# Altium schematic sheet SCIENCE_LED_BOARD.SchDoc: SPEXTRO - LED BOARD
size A4; Author: Matthew Glazer; Organization: RIT/SPEX; Address1: Rochester Institute of Technology; Address2: Rochester; Address3: New York; Address4: USA; Revision: 1A; SheetNumber: 1; SheetTotal: 1
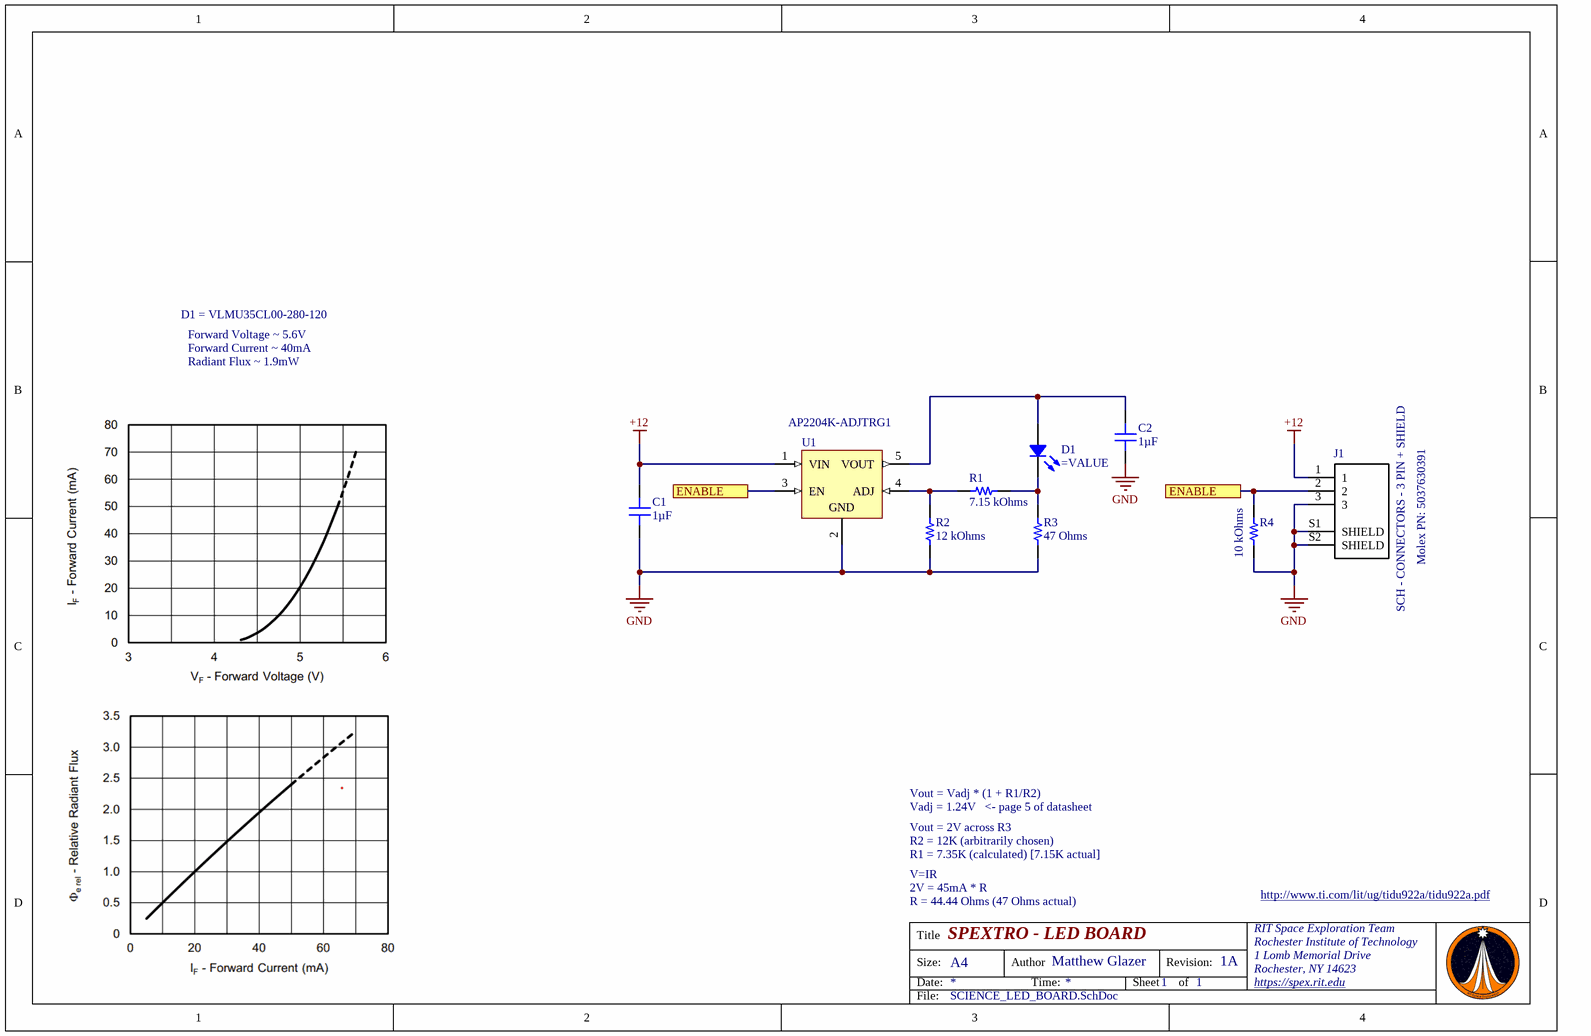
[diagram p0: SCIENCE_LED_BOARD.SchDoc]

## Parts
C1  1µF  [CAP 0603_1608]
C2  1µF  [CAP 0603_1608]
D1  (no value)  [PCB - LED - VISHAY 1414_3535 UV]
J1  SCH - CONNECTORS - 3 PIN + SHIELD  [PCB - CONNECTOR - MOLEX - PICO-LOCK 5037630391]
R1  7.15 kOhms  [RES 0603_1608]
R2  12 kOhms  [RES 0603_1608]
R3  47 Ohms  [RES 0603_1608]
R4  10 kOhms  [RES 0603_1608]
U1  AP2204K-ADJTRG1  [DIOD-SOT23-5_V]

## Ports
ENABLE

## Nets
+12: C1.2 J1.1 U1.1(VIN)
GND: C1.1 C2.1 J1.3 J1.S1(SHIELD) J1.S2(SHIELD) R2.1 R3.1 R4.1 U1.2(GND)
ENABLE: J1.2 R4.2 U1.3(EN) ; port ENABLE
NetC2_2: C2.2 D1.1 U1.5(VOUT)
NetD1_2: D1.2 R1.2 R3.2
NetR1_1: R1.1 R2.2 U1.4(ADJ)

## Notes on the sheet
- D1 = VLMU35CL00-280-120
- Forward Voltage ~ 5.6V
- Radiant Flux ~ 1.9mW
- Forward Current ~ 40mA
- Molex PN: 5037630391
- Vout = Vadj * (1 + R1/R2)
- Vadj = 1.24V   <- page 5 of datasheet
- R2 = 12K (arbitrarily chosen)
- Vout = 2V across R3
- R1 = 7.35K (calculated) [7.15K actual]
- V=IR
- 2V = 45mA * R
- R = 44.44 Ohms (47 Ohms actual)
- http://www.ti.com/lit/ug/tidu922a/tidu922a.pdf
- Title
- Size:
- Date:
- A4
- Author
- Time:
- Sheet
- Revision:
- of
- RIT Space Exploration Team
- Rochester Institute of Technology
- 1 Lomb Memorial Drive
- Rochester, NY 14623
- https://spex.rit.edu
- File:

## Library data of the parts
C1 C2 = CC0603KRX5R8BB105: CAP CER 1UF 25V X5R 0603; Manufacturer: Yageo; Tolerance: ±10%; Part Number: CC0603KRX5R8BB105; Value: 1µF; Applications: General Purpose; Capacitance: 1µF; ComponentLink1Description: Datasheet; ComponentLink1URL: https://www.yageo.com/upload/media/product/productsearch/datasheet/mlcc/UPY-GPHC_X5R_4V-to-50V_25.pdf; ComponentLink2Description: DigiKey Link; ComponentLink2URL: http://digikey.com/product-detail/en/yageo/CC0603KRX5R8BB105/311-1445-1-ND/2833751; Device Package: 0603 (1608 Metric); LastUpdated: 1/21/2020 12:02:05 AM; Lifecycle Status: Active; Minimum Order: 1; Mounting Type: Surface Mount, MLCC; Operating Temperature: -55°C ~ 85°C; Package / Case: 0603 (1608 Metric); Packaging: TapeAndReel; PartId: 5146; Part Status: Active; Price: 0.01; Series: CC; Size / Dimension: 0.063" L x 0.031" W (1.60mm x 0.80mm); Supplier 1: DigiKey; Supplier Part Number 1: 311-1445-1-ND; Temperature Coefficient: X5R; Thickness (Max): 0.035" (0.90mm); Voltage - Rated: 25V
D1 = LED: Chip LED
J1 = SCH - CONNECTORS - 3 PIN + SHIELD: Connector Header Surface Mount, Right Angle 4 position 0.039 _1.00mm_; MF: Molex; MP: 5037630391; SnapEDA_Link: https://www.snapeda.com/parts/5037630491/Molex/view-part/3215405/?ref=snap; Package: None; Price: None; Availability: Unavailable; Value: *
R1 = RMCF0603FT7K15: RES 7.15K OHM 1% 1/10W 0603; Manufacturer: Stackpole Electronics Inc; Power (Watts): 0.1W, 1/10W; Temperature Coefficient: ±100ppm/°C; Part Number: RMCF0603FT7K15; Value: 7.15 kOhms; ComponentLink1Description: Datasheet; ComponentLink1URL: https://www.seielect.com/catalog/sei-packaging.pdf; ComponentLink2Description: DigiKey Link; ComponentLink2URL: http://digikey.com/product-detail/en/stackpole-electronics-inc/RMCF0603FT7K15/RMCF0603FT7K15CT-ND/1943048; Composition: Thick Film; Device Package: 0603 (1608 Metric); Features: Automotive AEC-Q200; Height - Seated (Max): 0.022" (0.55mm); LastUpdated: 1/21/2020 12:17:41 AM; Lifecycle Status: Active; Minimum Order: 1; Number of Terminations: 2; Operating Temperature: -55°C ~ 155°C; Package / Case: 0603 (1608 Metric); Packaging: CutTape; PartId: 22551; Part Status: Active; Price: 0.10; Ratings: AEC-Q200; Resistance: 7.15 kOhms; Series: RMCF; Size / Dimension: 0.061" L x 0.031" W (1.55mm x 0.80mm); Supplier 1: DigiKey; Supplier Part Number 1: RMCF0603FT7K15CT-ND; Supplier Device Package: 0603; Tolerance: ±1%
R2 = RMCF0603FT12K0: RES 12K OHM 1% 1/10W 0603; Manufacturer: Stackpole Electronics Inc; Power (Watts): 0.1W, 1/10W; Temperature Coefficient: ±100ppm/°C; Part Number: RMCF0603FT12K0; Value: 12 kOhms; ComponentLink1Description: Datasheet; ComponentLink1URL: https://www.seielect.com/catalog/sei-rmcf_rmcp.pdf; ComponentLink2Description: DigiKey Link; ComponentLink2URL: http://digikey.com/product-detail/en/stackpole-electronics-inc/RMCF0603FT12K0/RMCF0603FT12K0CT-ND/1943062; Composition: Thick Film; Device Package: 0603 (1608 Metric); Features: Automotive AEC-Q200; Height - Seated (Max): 0.022" (0.55mm); LastUpdated: 1/21/2020 12:22:42 AM; Lifecycle Status: Active; Minimum Order: 1; Number of Terminations: 2; Operating Temperature: -55°C ~ 155°C; Package / Case: 0603 (1608 Metric); Packaging: CutTape; PartId: 10636; Part Status: Active; Price: 0.10; Ratings: AEC-Q200; Resistance: 12 kOhms; Series: RMCF; Size / Dimension: 0.061" L x 0.031" W (1.55mm x 0.80mm); Supplier 1: DigiKey; Supplier Part Number 1: RMCF0603FT12K0CT-ND; Supplier Device Package: 0603; Tolerance: ±1%
R3 = RMCF0603FT47R0: RES 47 OHM 1% 1/10W 0603; Manufacturer: Stackpole Electronics Inc; Power (Watts): 0.1W, 1/10W; Temperature Coefficient: ±100ppm/°C; Part Number: RMCF0603FT47R0; Value: 47 Ohms; ComponentLink1Description: Datasheet; ComponentLink1URL: https://www.seielect.com/catalog/sei-rmcf_rmcp.pdf; ComponentLink2Description: DigiKey Link; ComponentLink2URL: http://digikey.com/product-detail/en/stackpole-electronics-inc/RMCF0603FT47R0/RMCF0603FT47R0CT-ND/1942954; Composition: Thick Film; Device Package: 0603 (1608 Metric); Features: Automotive AEC-Q200; Height - Seated (Max): 0.022" (0.55mm); LastUpdated: 1/21/2020 12:22:37 AM; Lifecycle Status: Active; Minimum Order: 1; Number of Terminations: 2; Operating Temperature: -55°C ~ 155°C; Package / Case: 0603 (1608 Metric); Packaging: CutTape; PartId: 10672; Part Status: Active; Price: 0.10; Ratings: AEC-Q200; Resistance: 47 Ohms; Series: RMCF; Size / Dimension: 0.061" L x 0.031" W (1.55mm x 0.80mm); Supplier 1: DigiKey; Supplier Part Number 1: RMCF0603FT47R0CT-ND; Supplier Device Package: 0603; Tolerance: ±1%
R4 = RMCF0603FT10K0: RES 10K OHM 1% 1/10W 0603; Manufacturer: Stackpole Electronics Inc; Power (Watts): 0.1W, 1/10W; Temperature Coefficient: ±100ppm/°C; Part Number: RMCF0603FT10K0; Value: 10 kOhms; ComponentLink1Description: Datasheet; ComponentLink1URL: https://www.seielect.com/catalog/sei-rmcf_rmcp.pdf; ComponentLink2Description: DigiKey Link; ComponentLink2URL: http://digikey.com/product-detail/en/stackpole-electronics-inc/RMCF0603FT10K0/RMCF0603FT10K0CT-ND/1943057; Composition: Thick Film; Device Package: 0603 (1608 Metric); Features: Automotive AEC-Q200; Height - Seated (Max): 0.022" (0.55mm); LastUpdated: 1/21/2020 12:15:03 AM; Lifecycle Status: Active; Minimum Order: 1; Number of Terminations: 2; Operating Temperature: -55°C ~ 155°C; Package / Case: 0603 (1608 Metric); Packaging: CutTape; PartId: 25663; Part Status: Active; Price: 0.10; Ratings: AEC-Q200; Resistance: 10 kOhms; Series: RMCF; Size / Dimension: 0.061" L x 0.031" W (1.55mm x 0.80mm); Supplier 1: DigiKey; Supplier Part Number 1: RMCF0603FT10K0CT-ND; Supplier Device Package: 0603; Tolerance: ±1%
U1 = CMP-2000-05784-1: Wide Input Voltage Range, Adjustable Output, 150 mA, -40 to 125 degC, 5-Pin SOT23, RoHS, Tape and Reel; Output Voltage: Adj; Brand: DiodesIncorporated; PSRR / Ripple Rejection - Typ: 60dB; Input Voltage MAX: 24V; Number of Outputs: 1Output; Input Voltage MIN: 2.3V; Reference Voltage: 1.24V; Line Regulation: 0.05%; Unit Weight: 0.001058oz; Load Regulation: 0.5%; Dropout Voltage - Max: 500mV; Output Current: 200mA; Mounting Technology: SurfaceMount; Package Reference: SOT23-5; Datasheet Version: Rev. 3-2, 06/2016; Package / Case: SOT-23-5; Mounting Style: SMD/SMT; Packaging: Reel; Series: AP2204K; Output Type: Adjustable; Product Category: LDOVoltageRegulators; RoHS: True; Datasheet URL: https://www.diodes.com/_files/datasheets/AP2204.pdf; Package Description: 5-Pin Small Outline Transistor, Body 2.96 x 1.6 mm, Pitch 0.95 mm; Maximum Operating Temperature: +85C; Minimum Operating Temperature: -40C; Manufacturer: DiodesIncorporated; Type: ULDORegulator; Manufacturer URL: http://www.diodes.com/; Product: LDORegulators; Factory Pack Quantity: 3000